# EAGLE design Esquemático (EAGLE 9.6.2)
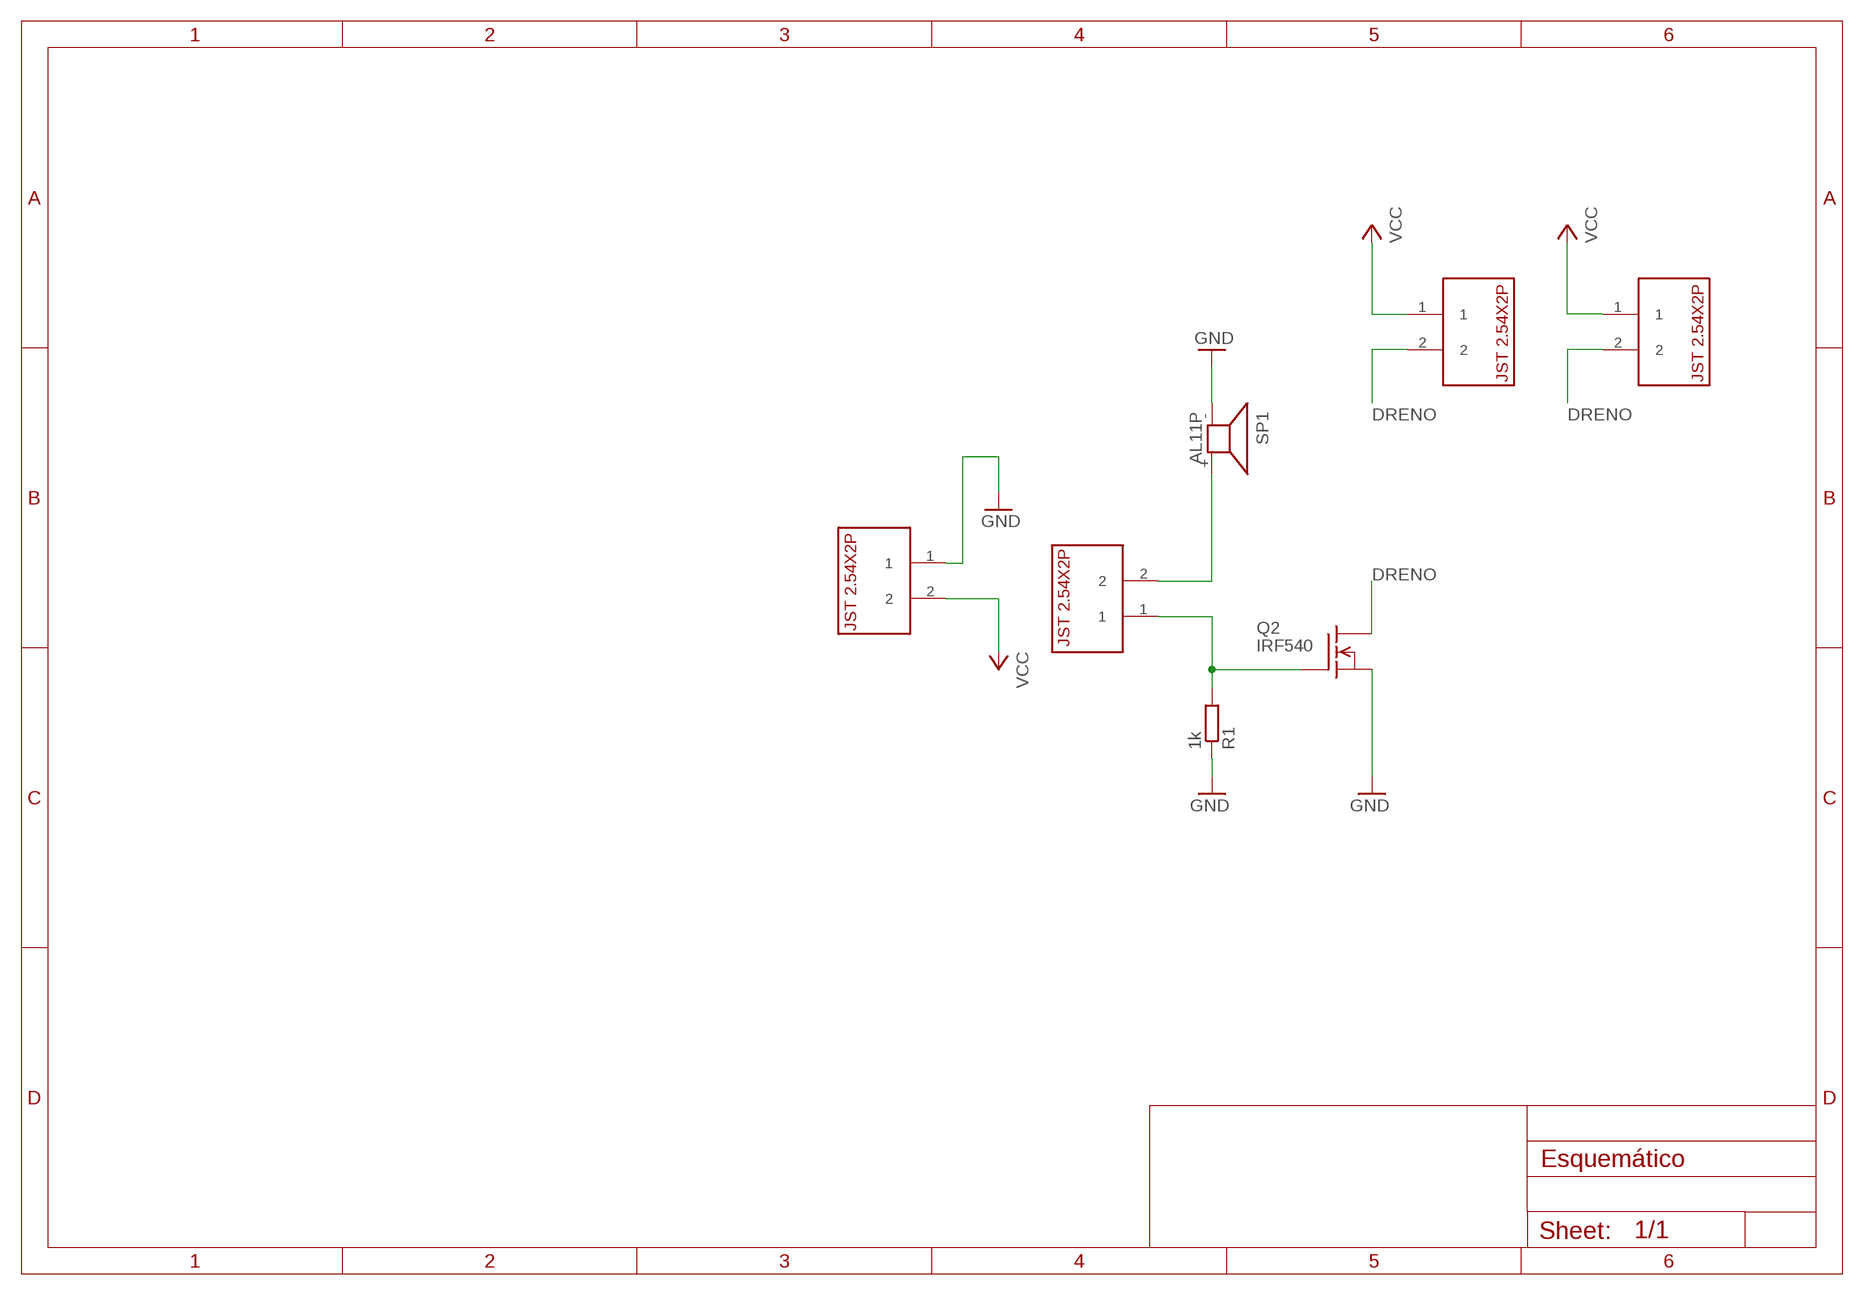
[diagram p0: schematic, sheet 1]

## Parts
Q2  IRF540  [TO220]
R1  1k  R-EU_0204/7  [0204/7]
SP1  AL11P  [AL11P]
U$1  JST2.54X2P  [JST2.54X2P_FOOTPRINT]
U$2  JST2.54X2P  [JST2.54X2P_FOOTPRINT]
U$3  JST2.54X2P  [JST2.54X2P_FOOTPRINT]
U$4  JST2.54X2P  [JST2.54X2P_FOOTPRINT]

## Nets
DRENO: Q2.2(D) U$2.2 U$3.2
GND: Q2.3(S) R1.1 SP1.- U$4.1
N$1: Q2.1(G) R1.2 U$1.1
N$3: SP1.+ U$1.2
VCC: U$2.1 U$3.1 U$4.2

## Library data of the parts
Q2 = transistor-fet:IRF540: N-Channel Enhancement MOSFET (HEXFET); 100V; 28A; 0,077Ohm
R1 = rcl:R-EU_: RESISTOR, European symbol; SPICEPREFIX: R
SP1 = buzzer:AL11P: SPEAKER Source: Buerklin; OC_FARNELL: unknown; OC_NEWARK: unknown
U$1-U$4 = CRD:JST2.54X2P: Conector JST 2 pinos (2.54mm de distância entre pinos)

## Board
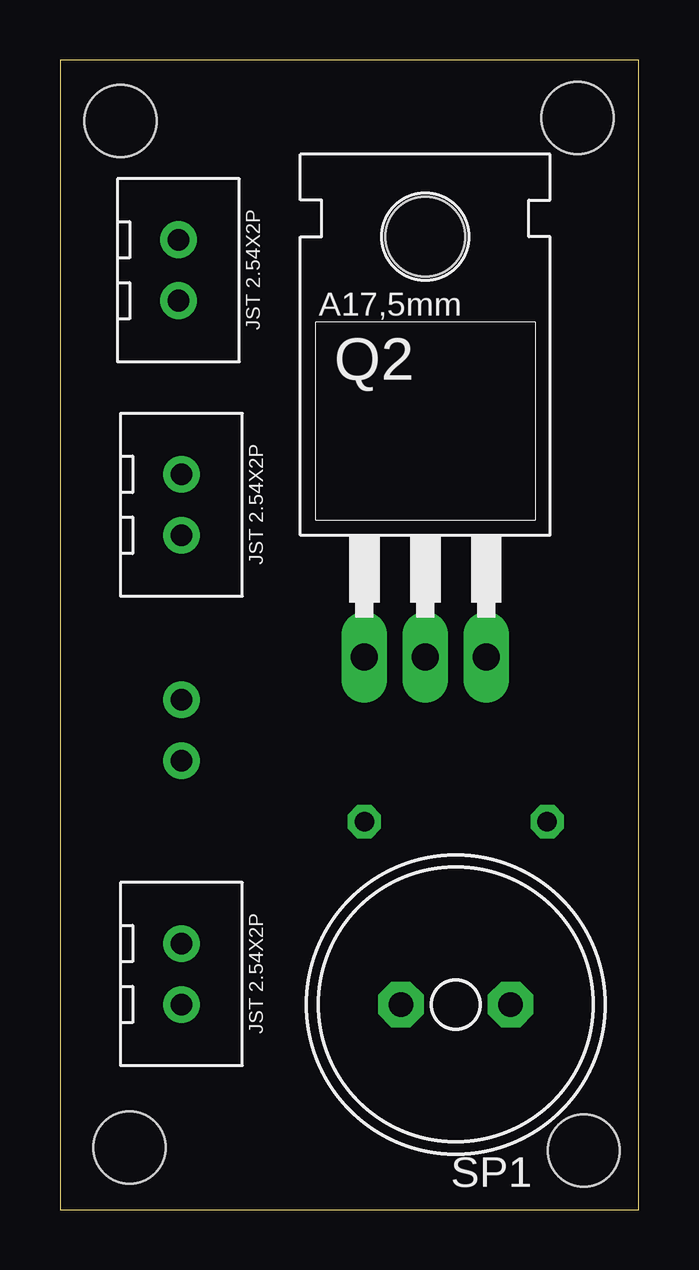
[diagram p1: board, top side]
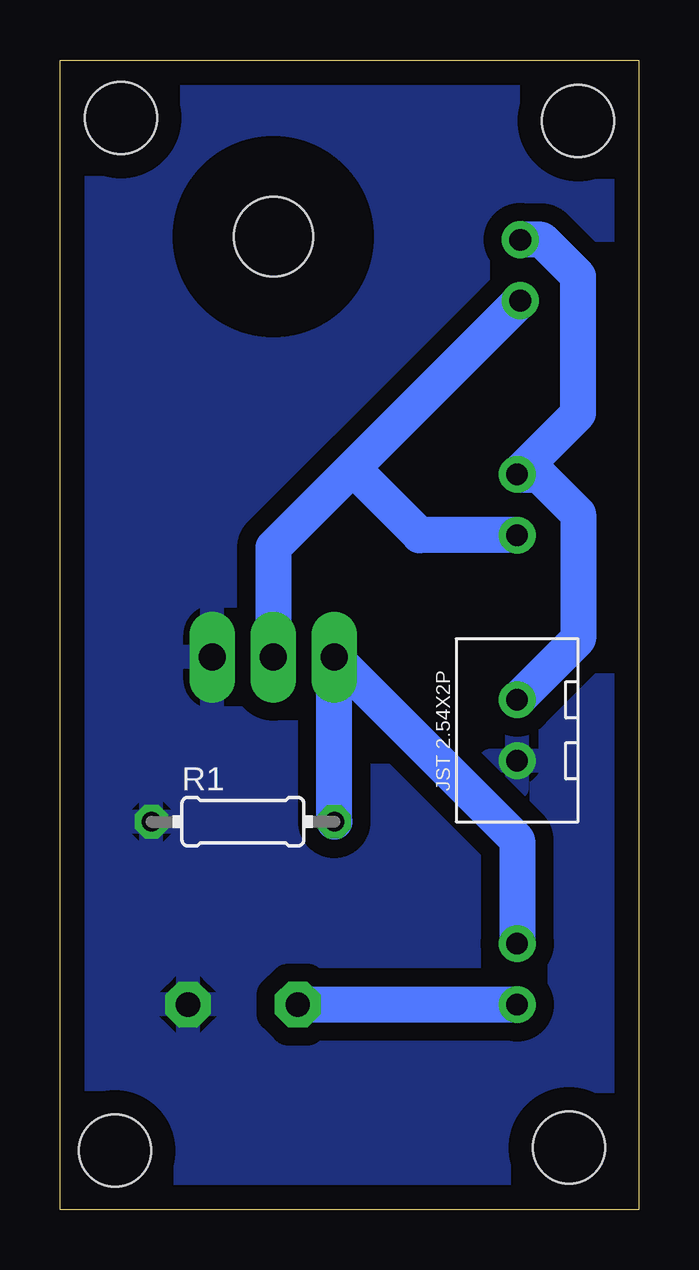
[diagram p2: board, bottom side, seen from below]

Size 24.11 x 47.93 mm. Coordinates in mm from the lower left corner, seen from the top.
Outline: 24.11,47.93 0,47.93 0,0 24.11,0 24.11,47.93
Copper layers (1*16): Top 0.035mm / dielectric 1.5mm / Bottom 0.035mm
Design rules "default": minimum track width 1.5mm, minimum drill 0.35mm, track to track 30mil, track to pad 20mil, pad to pad 6mil, via to via 6mil, smd to smd 6mil, copper to edge 40mil, drill to drill 6mil, minimum pad ring 10mil, minimum via ring 8mil, stop-mask expansion 4mil, vias tented up to drill 0mil, thermal gap 10mil
Holes 3 mm at 2.9,2.59 21.82,2.46 2.52,45.39 21.57,45.52

### Footprints (pad centres in the part's own frame; a part is rotated, then mirrored left to right if it is on the bottom)
TO220 = drill 1.118 pad 1.422 long: 1 -2.54,-6.35; 2 0,-6.35; 3 2.54,-6.35 | hole 3.302: 0,11.176
0204/7 = drill 0.813 octagon: 1 -3.81,0; 2 3.81,0
AL11P = drill 1.016 pad 1.905 octagon: + 2.286,0; - -2.286,0
JST2.54X2P_FOOTPRINT = drill 0.9: 1 -1.27,0; 2 1.27,0

### Placement (x,y rotation side)
Q2  15.22,29.39 0 top
R1  16.49,16.18 0 bottom
SP1  16.49,8.56 180 top
U$1  5.06,9.83 270 top
U$2  4.93,39.17 270 top
U$3  5.06,29.39 270 top
U$4  5.06,19.99 90 bottom

### Tracks (layer width: path | path; a pad name or v marks a point on that pad's centre or on a via)
DRENO
  Bottom 1.5: U$3.2 9.12,28.12 11.79,30.79 12.05,30.79 | Q2.2 15.22,27.61 12.05,30.79 | 12.05,30.79 U$2.2
GND
  pour Bottom: 0.74,47.17 0.74,0.81 23.48,0.81 23.48,47.3 0.87,47.3
N$1
  Bottom 1.5: R1.2 Q2.1 5.06,15.42 U$1.1
N$3
  Bottom 1.5: SP1.+ U$1.2
VCC
  Bottom 1.5: U$2.1 4.04,40.44 2.52,38.91 2.52,33.2 U$3.1 4.17,30.66 2.52,29.01 2.52,23.8 U$4.2